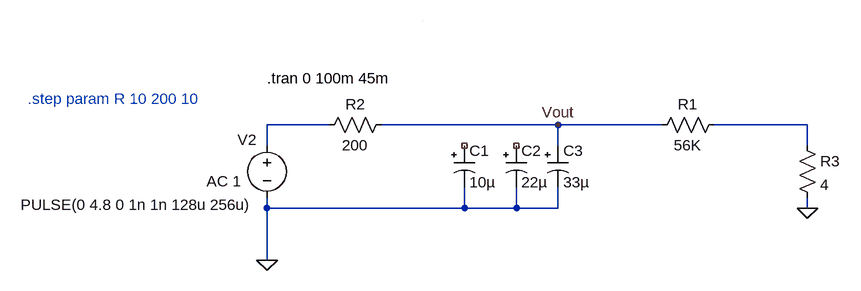
[diagram p0: schematic Arduino PWM Test.asc]
Arduino PWM Test.asc, the LTspice schematic file:
Version 4
SHEET 1 880 680
WIRE -144 160 -240 160
WIRE 208 160 -64 160
WIRE 368 160 208 160
WIRE 592 160 448 160
WIRE -240 192 -240 160
WIRE 208 192 208 160
WIRE 592 192 592 160
WIRE -240 288 -240 272
WIRE 64 288 64 256
WIRE 64 288 -240 288
WIRE 144 288 144 256
WIRE 144 288 64 288
WIRE 208 288 208 256
WIRE 208 288 144 288
WIRE 592 288 592 272
WIRE -240 368 -240 288
WIRE 0 0 0 0
FLAG -240 368 0
FLAG 208 160 Vout
FLAG 592 288 0
SYMBOL res -48 144 R90
WINDOW 0 0 56 VBottom 2
WINDOW 3 32 56 VTop 2
SYMATTR InstName R2
SYMATTR Value 200
SYMBOL voltage -240 176 R0
WINDOW 0 -45 7 Left 2
WINDOW 3 -379 107 Left 2
WINDOW 123 -93 71 Left 2
WINDOW 39 0 0 Left 2
SYMATTR InstName V2
SYMATTR Value PULSE(0 4.8 0 1n 1n 128u 256u)
SYMATTR Value2 AC 1
SYMBOL polcap 48 192 R0
WINDOW 3 24 56 Left 2
SYMATTR Value 10µ
SYMATTR InstName C1
SYMATTR Description Capacitor
SYMATTR Type cap
SYMATTR SpiceLine V=50 Irms=25m Rser=6.7 Lser=0
SYMBOL polcap 128 192 R0
WINDOW 3 24 56 Left 2
SYMATTR Value 22µ
SYMATTR InstName C2
SYMATTR Description Capacitor
SYMATTR Type cap
SYMATTR SpiceLine V=16 Irms=35m Rser=2.8 Lser=0
SYMBOL polcap 192 192 R0
WINDOW 3 24 56 Left 2
SYMATTR Value 33µ
SYMATTR InstName C3
SYMATTR Description Capacitor
SYMATTR Type cap
SYMATTR SpiceLine V=16 Irms=35m Rser=2.8 Lser=0
SYMBOL res 352 176 R270
WINDOW 0 32 56 VTop 2
WINDOW 3 0 56 VBottom 2
SYMATTR InstName R1
SYMATTR Value 56K
SYMBOL res 576 176 R0
SYMATTR InstName R3
SYMATTR Value 4
TEXT -240 88 Left 2 !.tran 0 100m 45m
TEXT -608 120 Left 2 ;.step param R 10 200 10

The netlist it stands for:
* Arduino PWM Test.asc
R2 Vout N001 200
V2 N001 0 PULSE(0 4.8 0 1n 1n 128u 256u) AC 1
C1 NC_01 0 10µ V=50 Irms=25m Rser=6.7 Lser=0
C2 NC_02 0 22µ V=16 Irms=35m Rser=2.8 Lser=0
C3 Vout 0 33µ V=16 Irms=35m Rser=2.8 Lser=0
R1 Vout N002 56K
R3 N002 0 4
.tran 0 100m 45m
* .step param R 10 200 10
.backanno
.end